# Altium project PCB_Project.PrjPcb
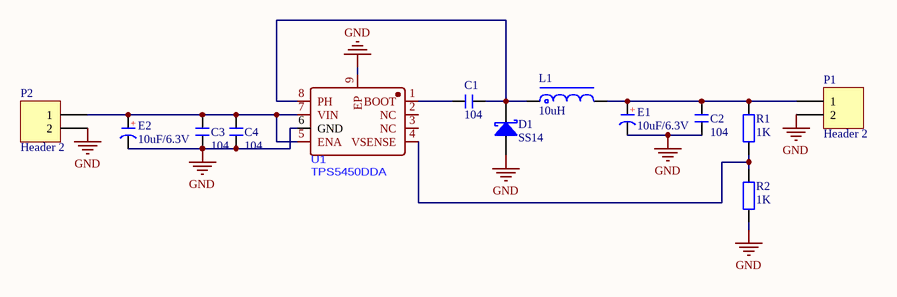
[diagram p0: Sheet1.SchDoc]
1 sheet, 13 parts. Net scope: global (net labels, ports and power ports of the same name join across sheets).
Board file: PCB1.PcbDoc

## Sheet Sheet1.SchDoc
size A4; SheetNumber: 1; SheetTotal: 1

### Parts
C1  104  [C 0805_L]
C2  104  [C 0805_L]
C3  104  [C 0805_L]
C4  104  [C 0805_L]
D1  SS14  [SMA]
E1  10uF/6.3V  [CS 2.0*5*8 - C]
E2  10uF/6.3V  [CS 2.0*5*8 - C]
L1  10uH  [CD31]
P1  Header 2  [HDR1X2]
P2  Header 2  [HDR1X2]
R1  1K  [R 0805_L]
R2  1K  [R 0805_L]
U1  TPS5450DDA  [SOP-8_L4.9-W3.9-P1.27-LS6.0-TL-EP-1]

### Nets
GND: C2.1 C3.1 C4.1 D1.1(A) E1.2(K) E2.2(K) P1.2 P2.2 R2.1 U1.6(GND) U1.9(EP)
NetC1_1: C1.1 D1.2(K) L1.1 U1.8(PH)
NetC1_2: C1.2 U1.1(BOOT)
NetC2_2: C2.2 E1.1(A) L1.2 P1.1 R1.2
NetC3_2: C3.2 C4.2 E2.1(A) P2.1 U1.5(ENA) U1.7(VIN)
NetR1_1: R1.1 R2.2 U1.4(VSENSE)

Not connected (* = marked no-connect by the designer): U1 2(NC) 3(NC)

### Notes on the sheet
- (in symbol CS) +

### Library data of the parts
C1-C4 = C: 贴片电容; 淘宝ID: 小糖豆的小窝窝; BOM名称: 贴片电容; 下单链接: https://item.taobao.com/item.htm?ft=t&id=613637044352
D1 = SS14: 肖特基二极管; 淘宝ID: 小糖豆的小窝窝; BOM名称: 肖特基二极管; 下单链接: https://item.taobao.com/item.htm?ft=t&id=613637044352
E1 E2 = CS: 直插固态电容; 淘宝ID: 小糖豆的小窝窝; BOM名称: 直插固态电容; 下单链接: https://item.taobao.com/item.htm?ft=t&id=613637044352
L1 = L-SMD: CD系列贴片线绕功率电感; 淘宝ID: 小糖豆的小窝窝; BOM名称: CD系列贴片线绕功率电感; 下单链接: https://item.taobao.com/item.htm?ft=t&id=613637044352
P1 P2 = Header 2: Header, 2-Pin; LatestRevisionDate: 17-Jul-2002; LatestRevisionNote: Re-released for DXP Platform.; Publisher: Altium Limited
R1 R2 = R: 贴片电阻; 淘宝ID: 小糖豆的小窝窝; BOM名称: 贴片电阻; 下单链接: https://item.taobao.com/item.htm?ft=t&id=613637044352